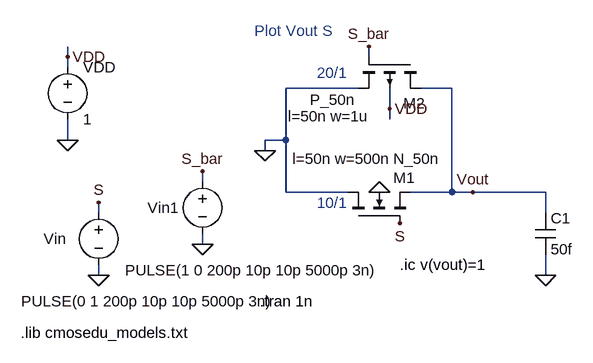
[diagram p0: schematic Fig13_4.asc]
Fig13_4.asc, the LTspice schematic file:
Version 4
SHEET 1 1136 680
WIRE 160 -336 160 -352
WIRE 160 -320 160 -336
WIRE 160 -208 160 -240
WIRE 208 -96 208 -112
WIRE 208 0 208 -16
WIRE 368 -144 368 -160
WIRE 368 -48 368 -64
WIRE 464 -192 464 -208
WIRE 496 -208 464 -208
WIRE 496 -208 496 -288
WIRE 496 -128 496 -208
WIRE 592 -128 496 -128
WIRE 608 -288 496 -288
WIRE 624 -336 624 -352
WIRE 656 -256 656 -288
WIRE 656 -240 656 -256
WIRE 752 -288 704 -288
WIRE 752 -128 688 -128
WIRE 752 -128 752 -288
WIRE 784 -128 752 -128
WIRE 896 -128 784 -128
WIRE 896 -96 896 -128
WIRE 896 0 896 -32
FLAG 208 0 0
FLAG 896 0 0
FLAG 784 -128 Vout
FLAG 208 -112 S
FLAG 640 -128 0
FLAG 160 -208 0
FLAG 160 -336 VDD
FLAG 656 -256 VDD
FLAG 464 -192 0
FLAG 672 -80 S
FLAG 368 -48 0
FLAG 368 -160 S_bar
FLAG 624 -352 S_bar
SYMBOL nmos4 592 -80 R270
WINDOW 0 70 70 VRight 0
WINDOW 3 99 70 VRight 0
WINDOW 123 99 -86 VRight 0
SYMATTR InstName M1
SYMATTR Value N_50n
SYMATTR Value2 l=50n w=500n
SYMBOL voltage 208 -112 R0
WINDOW 0 -85 56 Left 0
WINDOW 3 -119 152 Left 0
WINDOW 123 0 0 Left 0
WINDOW 39 0 0 Left 0
SYMATTR InstName Vin
SYMATTR Value PULSE(0 1 200p 10p 10p 5000p 3n)
SYMBOL cap 880 -96 R0
SYMATTR InstName C1
SYMATTR Value 50f
SYMBOL voltage 160 -336 R0
WINDOW 123 0 0 Left 0
WINDOW 39 0 0 Left 0
SYMATTR InstName VDD
SYMATTR Value 1
SYMBOL pmos4 704 -336 R90
WINDOW 0 71 -7 VRight 0
WINDOW 3 66 101 VRight 0
WINDOW 123 91 79 VRight 0
SYMATTR InstName M2
SYMATTR Value P_50n
SYMATTR Value2 l=50n w=1u
SYMBOL voltage 368 -160 R0
WINDOW 0 -85 56 Left 0
WINDOW 3 -119 152 Left 0
WINDOW 123 0 0 Left 0
WINDOW 39 0 0 Left 0
SYMATTR InstName Vin1
SYMATTR Value PULSE(1 0 200p 10p 10p 5000p 3n)
TEXT 456 40 Left 0 !.tran 1n
TEXT 88 88 Left 0 !.lib cmosedu_models.txt
TEXT 448 -376 Left 0 ;Plot Vout S
TEXT 544 -312 Left 0 ;20/1
TEXT 544 -112 Left 0 ;10/1
TEXT 672 -16 Left 0 !.ic v(vout)=1

The netlist it stands for:
* Fig13_4.asc
M1 0 S Vout 0 N_50n l=50n w=500n
Vin S 0 PULSE(0 1 200p 10p 10p 5000p 3n)
C1 Vout 0 50f
VDD VDD 0 1
M2 Vout S_bar 0 VDD P_50n l=50n w=1u
Vin1 S_bar 0 PULSE(1 0 200p 10p 10p 5000p 3n)
.model NMOS NMOS
.model PMOS PMOS
.lib standard.mos
.tran 1n
.lib cmosedu_models.txt
* Plot Vout S
* 20/1
* 10/1
.ic v(vout)=1
.backanno
.end